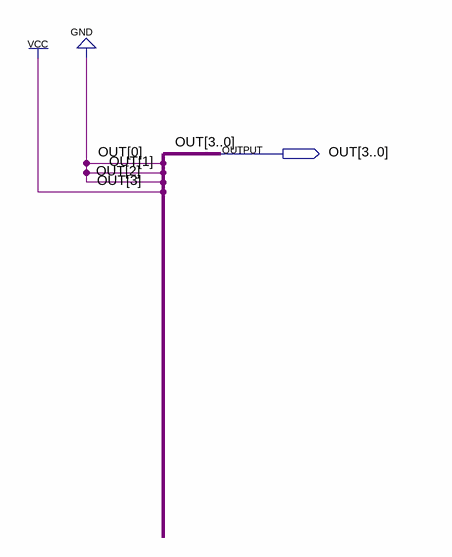
[diagram p0: schematic sheet]
// Quartus schematic MAISQUATRO.bdf as structural Verilog: 0 symbols, 1 pins
module MAISQUATRO (
  output [3:0] OUT
);


  assign OUT = 4'b1000;
endmodule
